# EAGLE design USB Flexer (EAGLE 7.5.0)
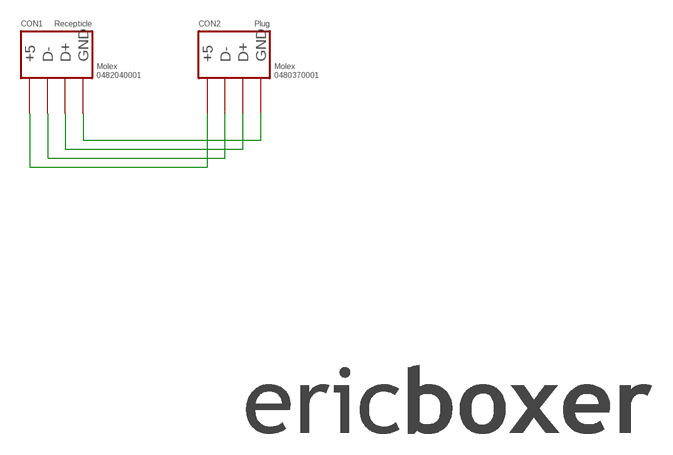
[diagram p0: schematic, sheet 1]

## Parts
CON1  USB_RECEPTICLE  [MOLEX_0482040001_RIGHT_ANGLE_RECEPTACLE]
CON2  USB_PLUG  [MOLEX_0480370001_PLUG_TYPE_A]
U$1  ERIC_BOXER_LOGO20  [BOXER_SHORTS_20MM]

## Nets
GND: CON1.GND CON1.GND@1(GND) CON1.GND@2(GND) CON1.GND@3(GND) CON1.GND@4(GND) CON2.GND CON2.GND@1(GND) CON2.GND@2(GND)
N$1: CON1.5V(+5) CON2.5+(+5)
N$2: CON1.D- CON2.D-
N$3: CON1.D+ CON2.D+

## Library data of the parts
CON1 = BoxLib USB:USB_RECEPTICLE; CONNECTOR: Recepticle; COST: 1.34; DATASHEET: http://bxhd.me/1OEjt07; DIGIKEY: WM17532-ND; DIGIKEY_URL: http://bxhd.me/1JgthR0; MANUF: Molex; MANUF_PN: 0482040001; MOUNTING: PTH; ORIENTATION: Right Angle. Vetical; SIZE: A
CON2 = BoxLib USB:USB_PLUG; CONNECTOR: Plug; COST: 1.19; DATASHEET: http://bxhd.me/1S4TROn; DIGIKEY: WM17117-ND; DIGIKEY_URL: http://bxhd.me/1S4TZxi; MANUF: Molex; MANUF_PN: 0480370001; MOUNTING: PTH; ORIENTATION: Right Angle, Horizontal; SIZE: A
U$1 = BoxLib:ERIC_BOXER_LOGO

## Board
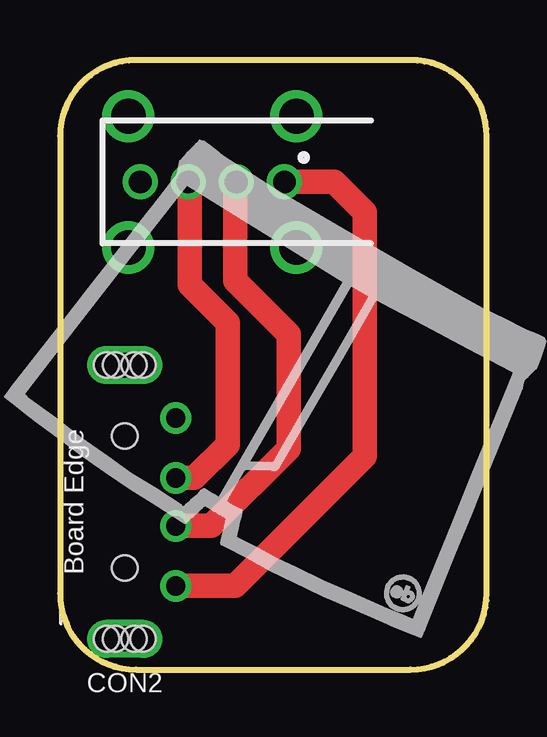
[diagram p1: board, top side]
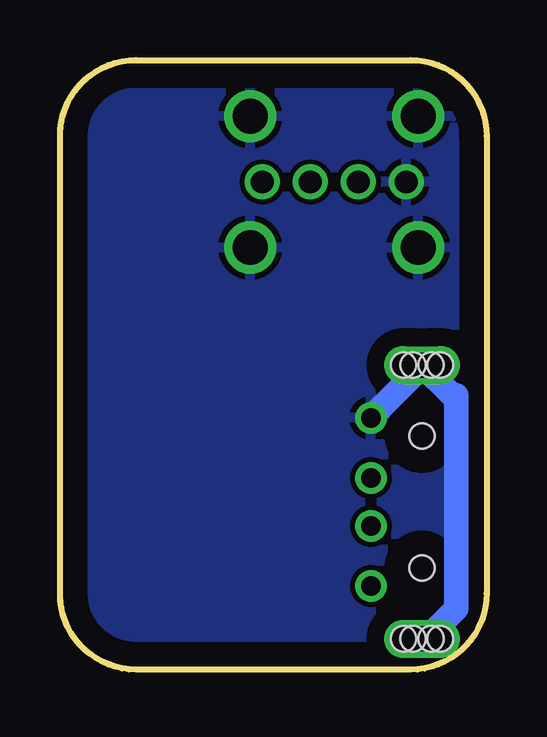
[diagram p2: board, bottom side, seen from below]

Size 17.78 x 25.4 mm. Coordinates in mm from the lower left corner, seen from the top.
Outline: 0,22.23 0,3.17 arc90 3.17,0 14.61,0 arc90 17.78,3.17 17.78,22.23 arc90 14.61,25.4 3.17,25.4 arc90 0,22.23
Copper layers (1*16): Top 0.035mm / dielectric 1.5mm / Bottom 0.035mm
Design rules "default": minimum track width 10mil, minimum drill 24mil, track to track 8mil, track to pad 8mil, pad to pad 8mil, via to via 8mil, smd to smd 8mil, copper to edge 40mil, drill to drill 8mil, minimum pad ring 10mil, minimum via ring 8mil, stop-mask expansion 4mil, vias tented up to drill 0mil, thermal gap 10mil

### Footprints (pad centres in the part's own frame; a part is rotated, then mirrored left to right if it is on the bottom)
MOLEX_0482040001_RIGHT_ANGLE_RECEPTACLE = drill 0.95: 5V 0,3; D+ 0,-1; D- 0,1; GND 0,-3 | drill 1.448: GND@1 -2.735,3.5; GND@2 2.735,3.5; GND@3 2.735,-3.5; GND@4 -2.735,-3.5
MOLEX_0480370001_PLUG_TYPE_A = drill 0.8: 5+ -3.5,-2.125; D+ 1,-2.125; D- -1,-2.125; GND 3.5,-2.125 | drill 1.05 long: GND@1 -5.7,0; GND@2 5.7,0 | hole 1.05: -2.75,0; 2.75,0; -5.7,0.762; -5.7,-0.762; -5.7,-0.381; -5.7,0.381; 5.7,0.762; 5.7,-0.762; 5.7,-0.381; 5.7,0.381

### Placement (x,y rotation side)
CON1  6.35,20.32 270 top
CON2  2.7,6.99 90 top
U$1  5.98,9.26 315 top

### Tracks (layer width: path | path; a pad name or v marks a point on that pad's centre or on a via)
GND
  Bottom 0.406: CON2.GND@2 2.7,12.61
  Bottom 1.016: 2.7,12.61 CON2.GND | CON2.GND@1 2.52,1.28 1.27,2.54 1.27,11.43 1.44,11.43 CON2.GND@2
  pour Bottom: 0,0 17.78,0 17.78,25.4 0,25.4
N$1
  Top 1.016: CON2.5+ 7.29,3.48 12.7,8.89 12.7,19.05 11.43,20.32 CON1.5V
N$2
  Top 0.406: 7.3,20.27 CON1.D-
  Top 1.016: CON2.D- 6.3,5.99 9.53,9.21 9.53,13.97 7.3,16.19 7.3,20.27
N$3
  Top 0.406: 5.4,20.27 CON1.D+
  Top 1.016: CON2.D+ 5.6,7.99 6.99,9.37 6.99,14.45 5.4,16.03 5.4,20.27